# EAGLE design osdelux_proto1_video (EAGLE 8.5.1)
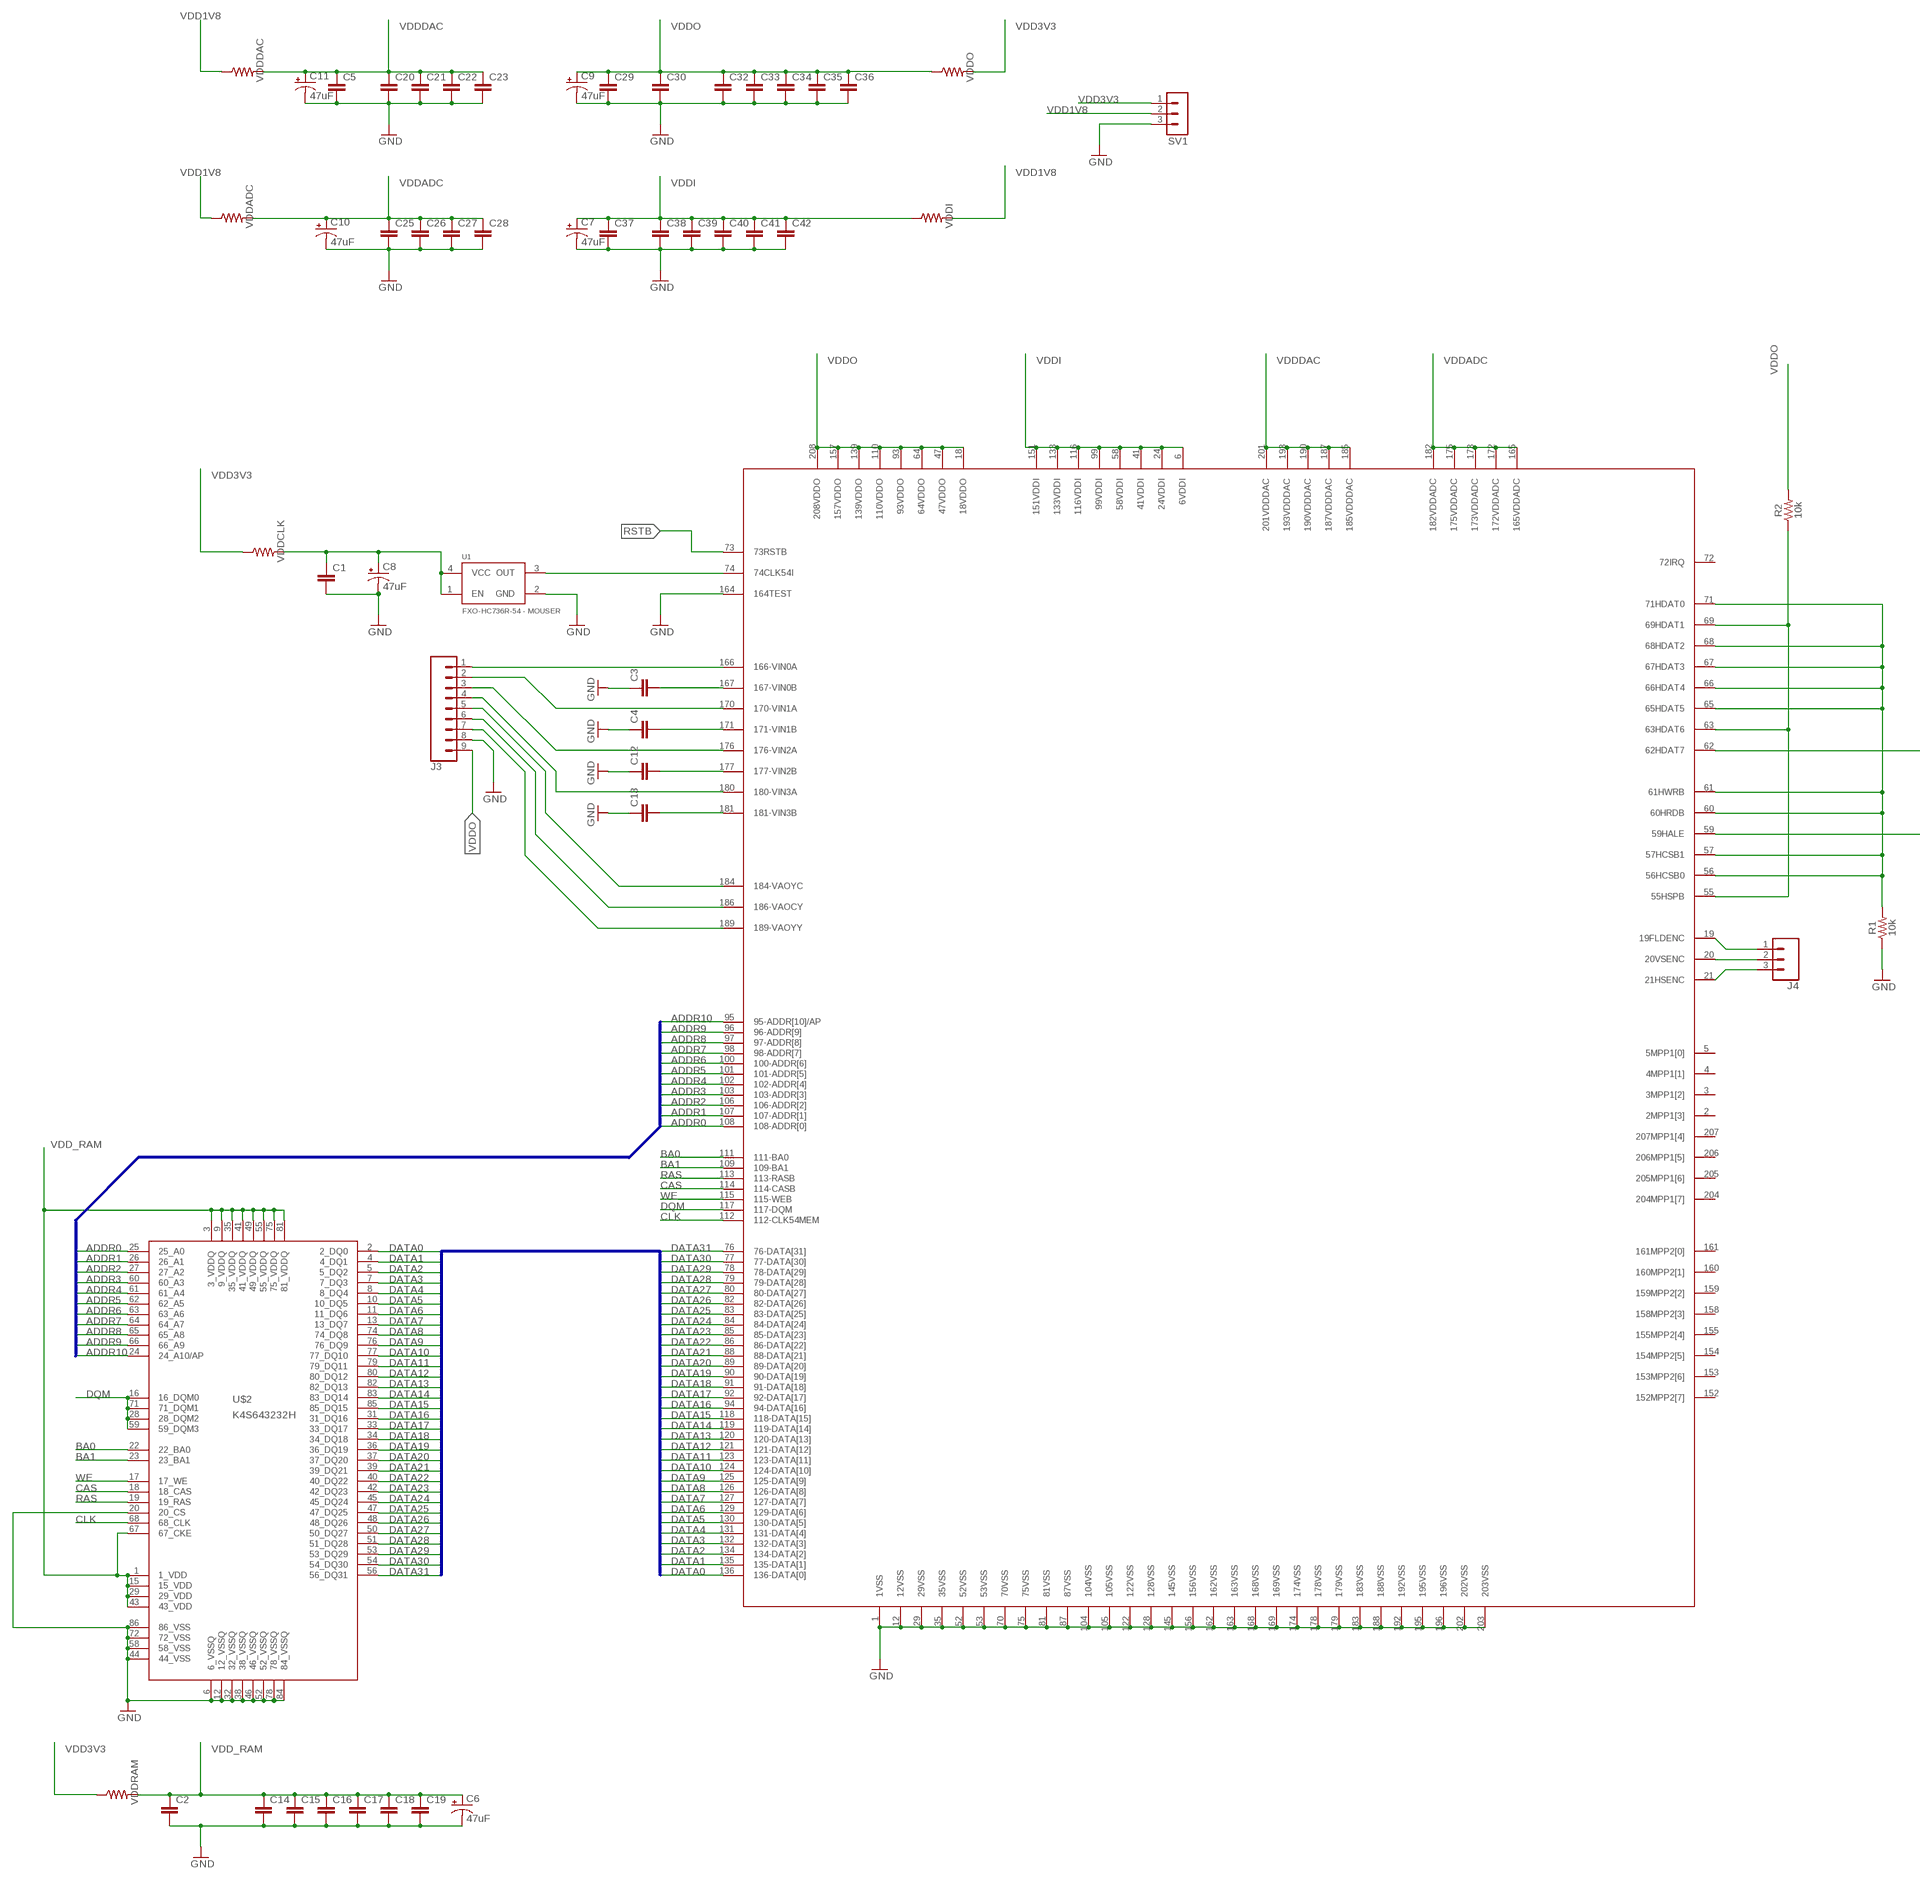
[diagram p0: schematic, sheet 1, part 1 of 2]
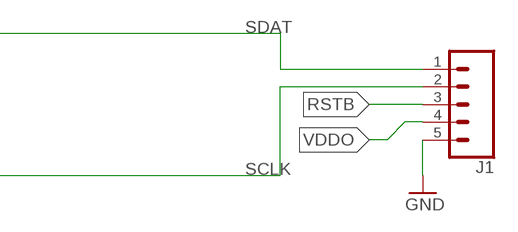
[diagram p1: schematic, sheet 1, part 2 of 2]

## Parts
C1  CAP0805  [0805]
C2  CAP0805  [0805]
C3  CAP0805  [0805]
C4  CAP0805  [0805]
C5  CAP0805  [0805]
C6  47uF  47UF-POLAR-EIA3528-10V-10%  [EIA3528]
C7  47uF  47UF-POLAR-EIA3528-10V-10%  [EIA3528]
C8  47uF  47UF-POLAR-EIA3528-10V-10%  [EIA3528]
C9  47uF  47UF-POLAR-EIA3528-10V-10%  [EIA3528]
C10  47uF  47UF-POLAR-EIA3528-10V-10%  [EIA3528]
C11  47uF  47UF-POLAR-EIA3528-10V-10%  [EIA3528]
C12  CAP0805  [0805]
C13  CAP0805  [0805]
C14  CAP0805  [0805]
C15  CAP0805  [0805]
C16  CAP0805  [0805]
C17  CAP0805  [0805]
C18  CAP0805  [0805]
C19  CAP0805  [0805]
C20  CAP0805  [0805]
C21  CAP0805  [0805]
C22  CAP0805  [0805]
C23  CAP0805  [0805]
C25  CAP0805  [0805]
C26  CAP0805  [0805]
C27  CAP0805  [0805]
C28  CAP0805  [0805]
C29  CAP0805  [0805]
C30  CAP0805  [0805]
C32  CAP0805  [0805]
C33  CAP0805  [0805]
C34  CAP0805  [0805]
C35  CAP0805  [0805]
C36  CAP0805  [0805]
C37  CAP0805  [0805]
C38  CAP0805  [0805]
C39  CAP0805  [0805]
C40  CAP0805  [0805]
C41  CAP0805  [0805]
C42  CAP0805  [0805]
J1  CONN_05LOCK_LONGPADS  [1X05_LOCK_LONGPADS]
J3  CONN_09LOCK-LONGPADS  [1X09_LOCK_LONGPADS]
J4  CONN_03LOCK_LONGPADS  [1X03_LOCK_LONGPADS]
R1  10k  RESISTOR0805  [0805]
R2  10k  RESISTOR0805  [0805]
SV1  MA03-1  [MA03-1]
U1  FXO-HC736R-54 - MOUSER  OSCILLATORSMD6  [CRYSTAL-SMD-7.5X5.2-6PIN]
U$1  TW2823  [LQFP208]
U$2  K4S643232H  [TSOP86]
VDDADC  RESISTOR1206  [1206]
VDDCLK  RESISTOR1206  [1206]
VDDDAC  RESISTOR1206  [1206]
VDDI  RESISTOR1206  [1206]
VDDO  RESISTOR1206  [1206]
VDDRAM  RESISTOR1206  [1206]

## Nets
ADDR0: U$1.108(108-ADDR[0]) U$2.25(25_A0)
ADDR1: U$1.107(107-ADDR[1]) U$2.26(26_A1)
ADDR2: U$1.106(106-ADDR[2]) U$2.27(27_A2)
ADDR3: U$1.103(103-ADDR[3]) U$2.60(60_A3)
ADDR4: U$1.102(102-ADDR[4]) U$2.61(61_A4)
ADDR5: U$1.101(101-ADDR[5]) U$2.62(62_A5)
ADDR6: U$1.100(100-ADDR[6]) U$2.63(63_A6)
ADDR7: U$1.98(98-ADDR[7]) U$2.64(64_A7)
ADDR8: U$1.97(97-ADDR[8]) U$2.65(65_A8)
ADDR9: U$1.96(96-ADDR[9]) U$2.66(66_A9)
ADDR10: U$1.95(95-ADDR[10]/AP) U$2.24(24_A10/AP)
BA0: U$1.111(111-BA0) U$2.22(22_BA0)
BA1: U$1.109(109-BA1) U$2.23(23_BA1)
CAS: U$1.114(114-CASB) U$2.18(18_CAS)
CLK: U$1.112(112-CLK54MEM) U$2.68(68_CLK)
DATA0: U$1.136(136-DATA[0]) U$2.2(2_DQ0)
DATA1: U$1.135(135-DATA[1]) U$2.4(4_DQ1)
DATA2: U$1.134(134-DATA[2]) U$2.5(5_DQ2)
DATA3: U$1.132(132-DATA[3]) U$2.7(7_DQ3)
DATA4: U$1.131(131-DATA[4]) U$2.8(8_DQ4)
DATA5: U$1.130(130-DATA[5]) U$2.10(10_DQ5)
DATA6: U$1.129(129-DATA[6]) U$2.11(11_DQ6)
DATA7: U$1.127(127-DATA[7]) U$2.13(13_DQ7)
DATA8: U$1.126(126-DATA[8]) U$2.74(74_DQ8)
DATA9: U$1.125(125-DATA[9]) U$2.76(76_DQ9)
DATA10: U$1.124(124-DATA[10]) U$2.77(77_DQ10)
DATA11: U$1.123(123-DATA[11]) U$2.79(79_DQ11)
DATA12: U$1.121(121-DATA[12]) U$2.80(80_DQ12)
DATA13: U$1.120(120-DATA[13]) U$2.82(82_DQ13)
DATA14: U$1.119(119-DATA[14]) U$2.83(83_DQ14)
DATA15: U$1.118(118-DATA[15]) U$2.85(85_DQ15)
DATA16: U$1.94(94-DATA[16]) U$2.31(31_DQ16)
DATA17: U$1.92(92-DATA[17]) U$2.33(33_DQ17)
DATA18: U$1.91(91-DATA[18]) U$2.34(34_DQ18)
DATA19: U$1.90(90-DATA[19]) U$2.36(36_DQ19)
DATA20: U$1.89(89-DATA[20]) U$2.37(37_DQ20)
DATA21: U$1.88(88-DATA[21]) U$2.39(39_DQ21)
DATA22: U$1.86(86-DATA[22]) U$2.40(40_DQ22)
DATA23: U$1.85(85-DATA[23]) U$2.42(42_DQ23)
DATA24: U$1.84(84-DATA[24]) U$2.45(45_DQ24)
DATA25: U$1.83(83-DATA[25]) U$2.47(47_DQ25)
DATA26: U$1.82(82-DATA[26]) U$2.48(48_DQ26)
DATA27: U$1.80(80-DATA[27]) U$2.50(50_DQ27)
DATA28: U$1.79(79-DATA[28]) U$2.51(51_DQ28)
DATA29: U$1.78(78-DATA[29]) U$2.53(53_DQ29)
DATA30: U$1.77(77-DATA[30]) U$2.54(54_DQ30)
DATA31: U$1.76(76-DATA[31]) U$2.56(56_DQ31)
DQM: U$1.117(117-DQM) U$2.16(16_DQM0) U$2.28(28_DQM2) U$2.59(59_DQM3) U$2.71(71_DQM1)
FLD: J4.1 U$1.19(19FLDENC)
GND: C1.2 C2.2 C3.1 C4.1 C5.2 C6.C(-) C7.C(-) C8.C(-) C9.C(-) C10.C(-) C11.C(-) C12.1 C13.1 C14.2 C15.2 C16.2 C17.2 C18.2 C19.2 C20.2 C21.2 C22.2 C23.2 C25.2 C26.2 C27.2 C28.2 C29.2 C30.2 C32.2 C33.2 C34.2 C35.2 C36.2 C37.2 C38.2 C39.2 C40.2 C41.2 C42.2 J1.5 J3.8 R1.1 SV1.3 U1.2(GND) U$1.1(1VSS) U$1.12(12VSS) U$1.29(29VSS) U$1.35(35VSS) U$1.52(52VSS) U$1.53(53VSS) U$1.70(70VSS) U$1.75(75VSS) U$1.81(81VSS) U$1.87(87VSS) U$1.104(104VSS) U$1.105(105VSS) U$1.122(122VSS) U$1.128(128VSS) U$1.145(145VSS) U$1.156(156VSS) U$1.162(162VSS) U$1.163(163VSS) U$1.164(164TEST) U$1.168(168VSS) U$1.169(169VSS) U$1.174(174VSS) U$1.178(178VSS) U$1.179(179VSS) U$1.183(183VSS) U$1.188(188VSS) U$1.192(192VSS) U$1.195(195VSS) U$1.196(196VSS) U$1.202(202VSS) U$1.203(203VSS) U$2.6(6_VSSQ) U$2.12(12_VSSQ) U$2.20(20_CS) U$2.32(32_VSSQ) U$2.38(38_VSSQ) U$2.44(44_VSS) U$2.46(46_VSSQ) U$2.52(52_VSSQ) U$2.58(58_VSS) U$2.72(72_VSS) U$2.78(78_VSSQ) U$2.84(84_VSSQ) U$2.86(86_VSS)
HSYNC: J4.3 U$1.21(21HSENC)
N$1: C1.1 C8.A(+) U1.1(EN) U1.4(VCC) VDDCLK.2
N$2: U1.3(OUT) U$1.74(74CLK54I)
N$6: C3.2 U$1.167(167-VIN0B)
N$7: C4.2 U$1.171(171-VIN1B)
N$8: C12.2 U$1.177(177-VIN2B)
N$10: C13.2 U$1.181(181-VIN3B)
N$18: R1.2 U$1.56(56HCSB0) U$1.57(57HCSB1) U$1.60(60HRDB) U$1.61(61HWRB) U$1.65(65HDAT5) U$1.66(66HDAT4) U$1.67(67HDAT3) U$1.68(68HDAT2) U$1.71(71HDAT0)
N$23: R2.1 U$1.55(55HSPB) U$1.63(63HDAT6) U$1.69(69HDAT1)
RAS: U$1.113(113-RASB) U$2.19(19_RAS)
RSTB: J1.3 U$1.73(73RSTB)
SCLK: J1.2 U$1.59(59HALE)
SDAT: J1.1 U$1.62(62HDAT7)
VAOCY: J3.6 U$1.186(186-VAOCY)
VAOYC: J3.5 U$1.184(184-VAOYC)
VAOYY: J3.7 U$1.189(189-VAOYY)
VDD1V8: SV1.2 VDDADC.1 VDDDAC.1 VDDI.2
VDD3V3: SV1.1 VDDCLK.1 VDDO.2 VDDRAM.1
VDD_RAM: C2.1 C6.A(+) C14.1 C15.1 C16.1 C17.1 C18.1 C19.1 U$2.1(1_VDD) U$2.3(3_VDDQ) U$2.9(9_VDDQ) U$2.15(15_VDD) U$2.29(29_VDD) U$2.35(35_VDDQ) U$2.41(41_VDDQ) U$2.43(43_VDD) U$2.49(49_VDDQ) U$2.55(55_VDDQ) U$2.67(67_CKE) U$2.75(75_VDDQ) U$2.81(81_VDDQ) VDDRAM.2
VDDADC: C10.A(+) C25.1 C26.1 C27.1 C28.1 U$1.165(165VDDADC) U$1.172(172VDDADC) U$1.173(173VDDADC) U$1.175(175VDDADC) U$1.182(182VDDADC) VDDADC.2
VDDDAC: C5.1 C11.A(+) C20.1 C21.1 C22.1 C23.1 U$1.185(185VDDDAC) U$1.187(187VDDDAC) U$1.190(190VDDDAC) U$1.193(193VDDDAC) U$1.201(201VDDDAC) VDDDAC.2
VDDI: C7.A(+) C37.1 C38.1 C39.1 C40.1 C41.1 C42.1 U$1.6(6VDDI) U$1.24(24VDDI) U$1.41(41VDDI) U$1.58(58VDDI) U$1.99(99VDDI) U$1.116(116VDDI) U$1.133(133VDDI) U$1.151(151VDDI) VDDI.1
VDDO: C9.A(+) C29.1 C30.1 C32.1 C33.1 C34.1 C35.1 C36.1 J1.4 J3.9 R2.2 U$1.18(18VDDO) U$1.47(47VDDO) U$1.64(64VDDO) U$1.93(93VDDO) U$1.110(110VDDO) U$1.139(139VDDO) U$1.157(157VDDO) U$1.208(208VDDO) VDDO.1
VIN0: J3.1 U$1.166(166-VIN0A)
VIN1: J3.2 U$1.170(170-VIN1A)
VIN2: J3.3 U$1.176(176-VIN2A)
VIN3: J3.4 U$1.180(180-VIN3A)
VSYNC: J4.2 U$1.20(20VSENC)
WE: U$1.115(115-WEB) U$2.17(17_WE)
Unconnected: U$1.2(2MPP1[3]) U$1.3(3MPP1[2]) U$1.4(4MPP1[1]) U$1.5(5MPP1[0]) U$1.152(152MPP2[7]) U$1.153(153MPP2[6]) U$1.154(154MPP2[5]) U$1.155(155MPP2[4]) U$1.158(158MPP2[3]) U$1.159(159MPP2[2]) U$1.160(160MPP2[1]) U$1.161(161MPP2[0]) U$1.204(204MPP1[7]) U$1.205(205MPP1[6]) U$1.206(206MPP1[5]) U$1.207(207MPP1[4])

## Buses
DATA[0..31]
ADDR[0..10]

## Power pins joined to a net without a drawn wire
72IRQ: U$1.72(72IRQ)

## Library data of the parts
C1-C5 C12-C23 C25-C30 C32-C42 = SparkFun:CAP: Capacitor Standard 0603 ceramic capacitor, and 0.1" leaded capacitor.
C6-C11 = SparkFun-Capacitors:47UF-POLAR: 47µF polarized capacitors A capacitor is a passive two-terminal electrical component used to store electrical energy temporarily in an electric field.; PROD_ID: CAP-08310
J1 = SparkFun-Connectors:CONN_05: Multi connection point. Often used as Generic Header-pin footprint for 0.1 inch spaced/style header connections On any of the 0.1 inch spaced packages, you can populate with these: Break Away Headers - Straight <https://www.sparkfun.com/products/116> (PRT-00116) Break Away Male Headers - Right Angle <https://www.sparkfun.com/products/553> (PRT-00553) Female Headers <https://www.sparkfun.com/products/115> (PRT-00115) Break Away Headers - Machine Pin <https://www.sparkfun.com/products/117> (PRT-00117) Break Away Female Headers - Swiss Machine Pin <https://www.sparkfun.com/products/743> (PRT-00743) For SCREWTERMINALS and SPRING TERMINALS visit here: Screw Terimnals on SparkFun.com <https://www.sparkfun.com/search/results?term=Screw+Terminals> (5mm/3.5mm/2.54mm spacing) This device is also useful as a general connection point to wire up your design to another part of your project. Our various solder wires solder well into these plated through hole pads. Hook-Up Wire - Assortment (Stranded, 22 AWG) <https://www.sparkfun.com/products/11375> (PRT-11375) Hook-Up Wire - Assortment (Solid Core, 22 AWG) <https://www.sparkfun.com/products/11367> (PRT-11367) View the entire wire category on our website here <https://www.sparkfun.com/categories/141> Special notes: Molex polarized connector foot print use with SKU : PRT-08231 with associated crimp pins and housings. 1MM SMD Version SKU: PRT-10208
J3 = SparkFun-Connectors:CONN_09: Multi connection point. Often used as Generic Header-pin footprint for 0.1 inch spaced/style header connections On any of the 0.1 inch spaced packages, you can populate with these: Break Away Headers - Straight <https://www.sparkfun.com/products/116> (PRT-00116) Break Away Male Headers - Right Angle <https://www.sparkfun.com/products/553> (PRT-00553) Female Headers <https://www.sparkfun.com/products/115> (PRT-00115) Break Away Headers - Machine Pin <https://www.sparkfun.com/products/117> (PRT-00117) Break Away Female Headers - Swiss Machine Pin <https://www.sparkfun.com/products/743> (PRT-00743) For SCREWTERMINALS and SPRING TERMINALS visit here: Screw Terimnals on SparkFun.com <https://www.sparkfun.com/search/results?term=Screw+Terminals> (5mm/3.5mm/2.54mm spacing) This device is also useful as a general connection point to wire up your design to another part of your project. Our various solder wires solder well into these plated through hole pads. Hook-Up Wire - Assortment (Stranded, 22 AWG) <https://www.sparkfun.com/products/11375> (PRT-11375) Hook-Up Wire - Assortment (Solid Core, 22 AWG) <https://www.sparkfun.com/products/11367> (PRT-11367) View the entire wire category on our website here <https://www.sparkfun.com/categories/141> Special notes: Molex polarized connector foot print use with SKU : PRT-08231 with associated crimp pins and housings. 1MM SMD Version SKU: PRT-10208 NOTES ON THE VARIANTS LOCK and LOCK_LONGPADS... This footprint was designed to help hold the alignment of a through-hole component (i.e. 6-pin header) while soldering it into place. You may notice that each hole has been shifted either up or down by 0.005 of an inch from it's more standard position (which is a perfectly straight line). This slight alteration caused the pins (the squares in the middle) to touch the edges of the holes. Because they are alternating, it causes a "brace" to hold the component in place. 0.005 has proven to be the perfect amount of "off-center" position when using our standard breakaway headers. Although looks a little odd when you look at the bare footprint, once you have a header in there, the alteration is very hard to notice. Also,if you push a header all the way into place, it is covered up entirely on the bottom side.
J4 = SparkFun-Connectors:CONN_03: Multi connection point. Often used as Generic Header-pin footprint for 0.1 inch spaced/style header connections On any of the 0.1 inch spaced packages, you can populate with these: Break Away Headers - Straight <https://www.sparkfun.com/products/116> (PRT-00116) Break Away Male Headers - Right Angle <https://www.sparkfun.com/products/553> (PRT-00553) Female Headers <https://www.sparkfun.com/products/115> (PRT-00115) Break Away Headers - Machine Pin <https://www.sparkfun.com/products/117> (PRT-00117) Break Away Female Headers - Swiss Machine Pin <https://www.sparkfun.com/products/743> (PRT-00743) Stackable Header - 3 Pin (Female, 0.1") <https://www.sparkfun.com/products/13875> (PRT-13875) For SCREWTERMINALS and SPRING TERMINALS visit here: Screw Terimnals on SparkFun.com <https://www.sparkfun.com/search/results?term=Screw+Terminals> (5mm/3.5mm/2.54mm spacing) This device is also useful as a general connection point to wire up your design to another part of your project. Our various solder wires solder well into these plated through hole pads. Hook-Up Wire - Assortment (Stranded, 22 AWG) <https://www.sparkfun.com/products/11375> (PRT-11375) Hook-Up Wire - Assortment (Solid Core, 22 AWG) <https://www.sparkfun.com/products/11367> (PRT-11367) View the entire wire category on our website here <https://www.sparkfun.com/categories/141> Special notes: Molex polarized connector foot print use with SKU : PRT-08232 with associated crimp pins and housings.
R1 R2 VDDADC VDDCLK VDDDAC VDDI VDDO VDDRAM = SparkFun-Resistors:RESISTOR: Generic Resistor Package
SV1 = con-lstb:MA03-1: PIN HEADER; OC_FARNELL: unknown; OC_NEWARK: unknown
U1 = SparkFun:OSCILLATOR
U$1 = microbuilder:TW2823
U$2 = sdram:K4S643232H

## Board
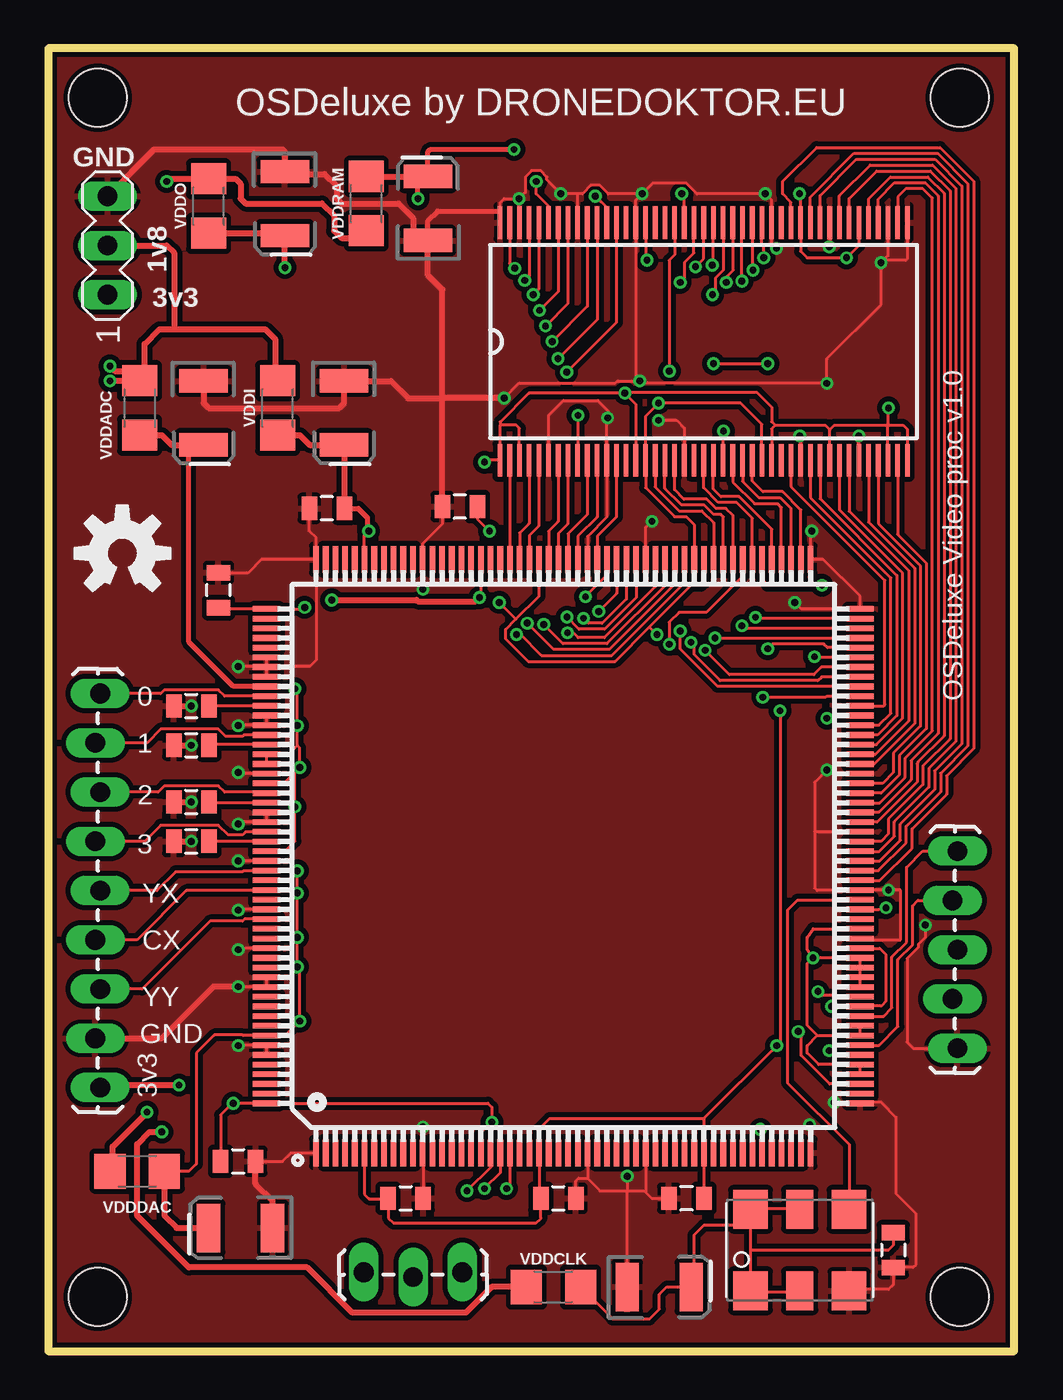
[diagram p2: board, top side]
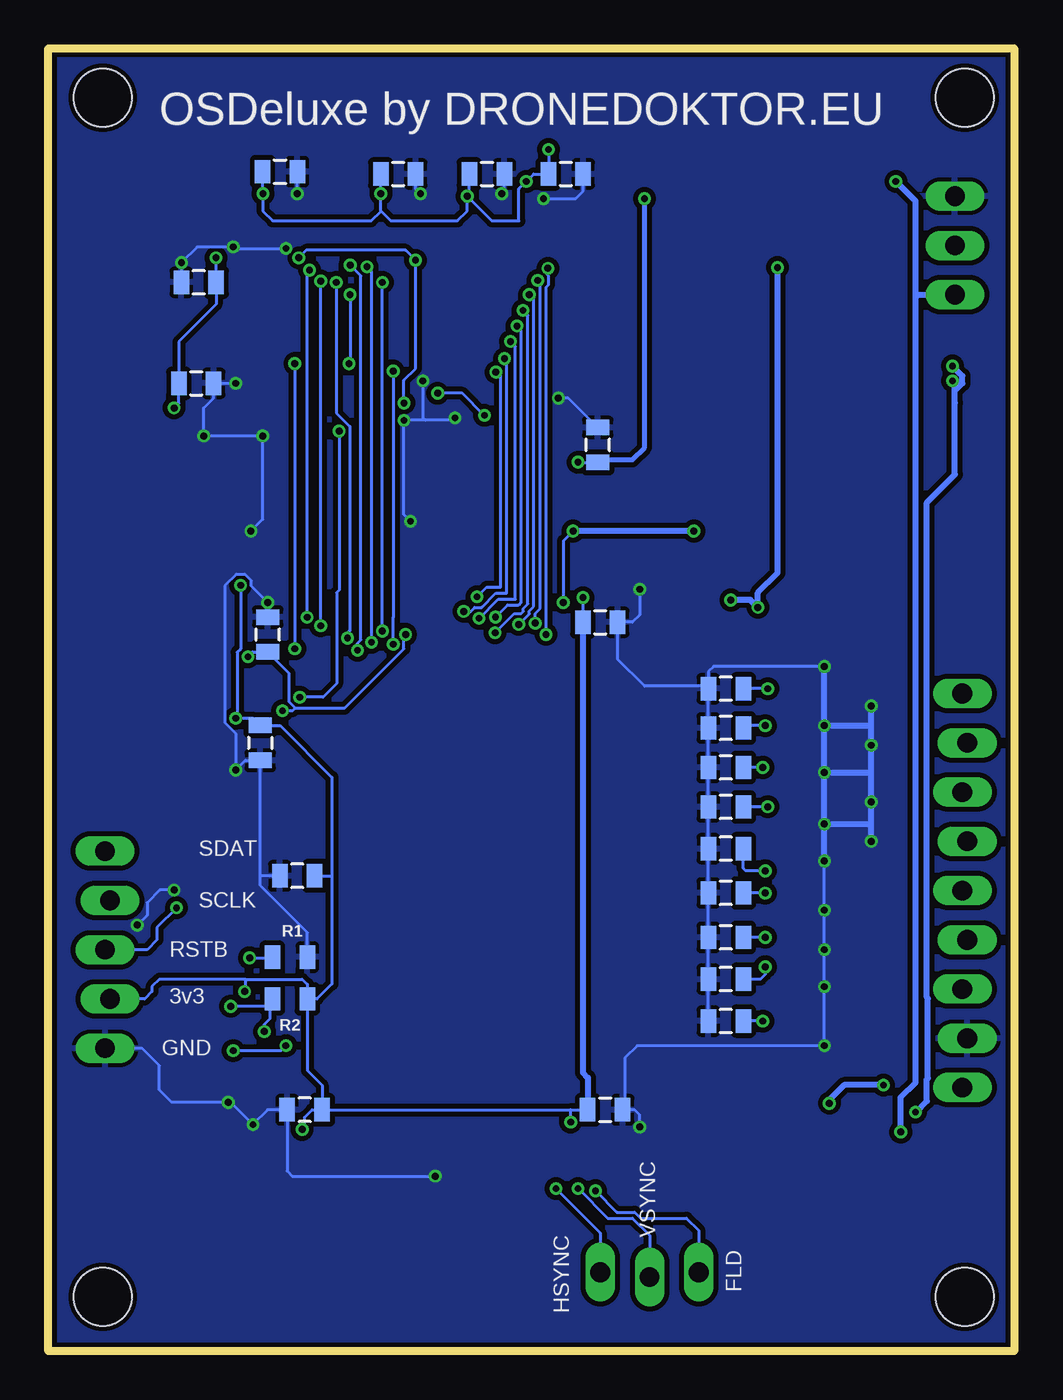
[diagram p3: board, bottom side, seen from below]

Size 49.78 x 67.18 mm. Coordinates in mm from the lower left corner, seen from the top.
Outline: 0,0 49.78,0 49.78,67.18 0,67.18 0,0
Copper layers (1*16): Top 0.018mm / dielectric 1.55mm / Bottom 0.018mm
Design rules "default *": minimum track width 6mil, minimum drill 0.3mm, track to track 6mil, track to pad 6mil, pad to pad 6mil, via to via 6mil, smd to smd 0mil, copper to edge 0.25mm, drill to drill 0.35mm, minimum pad ring 6mil, minimum via ring 6mil, stop-mask expansion 0mil, vias tented up to drill 0.45mm, thermal gap 0.2mm
Holes 3 mm at 46.99,2.79 46.99,64.64 2.54,64.64 2.54,2.79

### Footprints (pad centres in the part's own frame; a part is rotated, then mirrored left to right if it is on the bottom)
0805 = smd 0.8 x 1.2: 1 -0.9,0; 2 0.9,0
EIA3528 = smd 1.2 x 2.5: A 1.65,0; C -1.65,0
1X05_LOCK_LONGPADS = drill 1.016 long: 1 0,0; 2 2.54,-0.254; 3 5.08,0; 4 7.62,-0.254; 5 10.16,0
1X09_LOCK_LONGPADS = drill 1.016 long: 1 0,0.127; 2 2.54,-0.127; 3 5.08,0.127; 4 7.62,-0.127; 5 10.16,0.127; 6 12.7,-0.127; 7 15.24,0.127; 8 17.78,-0.127; 9 20.32,0.127
1X03_LOCK_LONGPADS = drill 1.016 long: 1 0,0; 2 2.54,-0.254; 3 5.08,0
MA03-1 = drill 1.016 long: 1 -2.54,0; 2 0,0; 3 2.54,0
CRYSTAL-SMD-7.5X5.2-6PIN = smd 1.8 x 2: 1 -2.54,-2.1; 2 2.54,-2.1; 3 2.54,2.1; 4 -2.54,2.1 | smd 1.4 x 2: NC0 0,-2.1; NC1 0,2.1
LQFP208 = smd 1.4 x 0.29: 1 -15.3,12.75; 2 -15.3,12.25; 3 -15.3,11.75; 4 -15.3,11.25; 5 -15.3,10.75; 6 -15.3,10.25; 7 -15.3,9.75; 8 -15.3,9.25; 9 -15.3,8.75; 10 -15.3,8.25; 11 -15.3,7.75; 12 -15.3,7.25; 13 -15.3,6.75; 14 -15.3,6.25; 15 -15.3,5.75; 16 -15.3,5.25; 17 -15.3,4.75; 18 -15.3,4.25; 19 -15.3,3.75; 20 -15.3,3.25; 21 -15.3,2.75; 22 -15.3,2.25; 23 -15.3,1.75; 24 -15.3,1.25; 25 -15.3,0.75; 26 -15.3,0.25; 27 -15.3,-0.25; 28 -15.3,-0.75; 29 -15.3,-1.25; 30 -15.3,-1.75; 31 -15.3,-2.25; 32 -15.3,-2.75; 33 -15.3,-3.25; 34 -15.3,-3.75; 35 -15.3,-4.25; 36 -15.3,-4.75; 37 -15.3,-5.25; 38 -15.3,-5.75; 39 -15.3,-6.25; 40 -15.3,-6.75; 41 -15.3,-7.25; 42 -15.3,-7.75; 43 -15.3,-8.25; 44 -15.3,-8.75; 45 -15.3,-9.25; 46 -15.3,-9.75; 47 -15.3,-10.25; 48 -15.3,-10.75; 49 -15.3,-11.25; 50 -15.3,-11.75; 51 -15.3,-12.25; 52 -15.3,-12.75; 105 15.3,-12.75; 106 15.3,-12.25; 107 15.3,-11.75; 108 15.3,-11.25; 109 15.3,-10.75; 110 15.3,-10.25; 111 15.3,-9.75; 112 15.3,-9.25; 113 15.3,-8.75; 114 15.3,-8.25; 115 15.3,-7.75; 116 15.3,-7.25; 117 15.3,-6.75; 118 15.3,-6.25; 119 15.3,-5.75; 120 15.3,-5.25; 121 15.3,-4.75; 122 15.3,-4.25; 123 15.3,-3.75; 124 15.3,-3.25; 125 15.3,-2.75; 126 15.3,-2.25; 127 15.3,-1.75; 128 15.3,-1.25; 129 15.3,-0.75; 130 15.3,-0.25; 131 15.3,0.25; 132 15.3,0.75; 133 15.3,1.25; 134 15.3,1.75; 135 15.3,2.25; 136 15.3,2.75; 137 15.3,3.25; 138 15.3,3.75; 139 15.3,4.25; 140 15.3,4.75; 141 15.3,5.25; 142 15.3,5.75; 143 15.3,6.25; 144 15.3,6.75; 145 15.3,7.25; 146 15.3,7.75; 147 15.3,8.25; 148 15.3,8.75; 149 15.3,9.25; 150 15.3,9.75; 151 15.3,10.25; 152 15.3,10.75; 153 15.3,11.25; 154 15.3,11.75; 155 15.3,12.25; 156 15.3,12.75 | smd 0.29 x 1.4: 53 -12.75,-15.3; 54 -12.25,-15.3; 55 -11.75,-15.3; 56 -11.25,-15.3; 57 -10.75,-15.3; 58 -10.25,-15.3; 59 -9.75,-15.3; 60 -9.25,-15.3; 61 -8.75,-15.3; 62 -8.25,-15.3; 63 -7.75,-15.3; 64 -7.25,-15.3; 65 -6.75,-15.3; 66 -6.25,-15.3; 67 -5.75,-15.3; 68 -5.25,-15.3; 69 -4.75,-15.3; 70 -4.25,-15.3; 71 -3.75,-15.3; 72 -3.25,-15.3; 73 -2.75,-15.3; 74 -2.25,-15.3; 75 -1.75,-15.3; 76 -1.25,-15.3; 77 -0.75,-15.3; 78 -0.25,-15.3; 79 0.25,-15.3; 80 0.75,-15.3; 81 1.25,-15.3; 82 1.75,-15.3; 83 2.25,-15.3; 84 2.75,-15.3; 85 3.25,-15.3; 86 3.75,-15.3; 87 4.25,-15.3; 88 4.75,-15.3; 89 5.25,-15.3; 90 5.75,-15.3; 91 6.25,-15.3; 92 6.75,-15.3; 93 7.25,-15.3; 94 7.75,-15.3; 95 8.25,-15.3; 96 8.75,-15.3; 97 9.25,-15.3; 98 9.75,-15.3; 99 10.25,-15.3; 100 10.75,-15.3; 101 11.25,-15.3; 102 11.75,-15.3; 103 12.25,-15.3; 104 12.75,-15.3; 157 12.75,15.3; 158 12.25,15.3; 159 11.75,15.3; 160 11.25,15.3; 161 10.75,15.3; 162 10.25,15.3; 163 9.75,15.3; 164 9.25,15.3; 165 8.75,15.3; 166 8.25,15.3; 167 7.75,15.3; 168 7.25,15.3; 169 6.75,15.3; 170 6.25,15.3; 171 5.75,15.3; 172 5.25,15.3; 173 4.75,15.3; 174 4.25,15.3; 175 3.75,15.3; 176 3.25,15.3; 177 2.75,15.3; 178 2.25,15.3; 179 1.75,15.3; 180 1.25,15.3; 181 0.75,15.3; 182 0.25,15.3; 183 -0.25,15.3; 184 -0.75,15.3; 185 -1.25,15.3; 186 -1.75,15.3; 187 -2.25,15.3; 188 -2.75,15.3; 189 -3.25,15.3; 190 -3.75,15.3; 191 -4.25,15.3; 192 -4.75,15.3; 193 -5.25,15.3; 194 -5.75,15.3; 195 -6.25,15.3; 196 -6.75,15.3; 197 -7.25,15.3; 198 -7.75,15.3; 199 -8.25,15.3; 200 -8.75,15.3; 201 -9.25,15.3; 202 -9.75,15.3; 203 -10.25,15.3; 204 -10.75,15.3; 205 -11.25,15.3; 206 -11.75,15.3; 207 -12.25,15.3; 208 -12.75,15.3
TSOP86 = smd 1.7 x 0.24: 1 -6.13,10.5; 2 -6.13,10; 3 -6.13,9.5; 4 -6.13,9; 5 -6.13,8.5; 6 -6.13,8; 7 -6.13,7.5; 8 -6.13,7; 9 -6.13,6.5; 10 -6.13,6; 11 -6.13,5.5; 12 -6.13,5; 13 -6.13,4.5; 14 -6.13,4; 15 -6.13,3.5; 16 -6.13,3; 17 -6.13,2.5; 18 -6.13,2; 19 -6.13,1.5; 20 -6.13,1; 21 -6.13,0.5; 22 -6.13,0; 23 -6.13,-0.5; 24 -6.13,-1; 25 -6.13,-1.5; 26 -6.13,-2; 27 -6.13,-2.5; 28 -6.13,-3; 29 -6.13,-3.5; 30 -6.13,-4; 31 -6.13,-4.5; 32 -6.13,-5; 33 -6.13,-5.5; 34 -6.13,-6; 35 -6.13,-6.5; 36 -6.13,-7; 37 -6.13,-7.5; 38 -6.13,-8; 39 -6.13,-8.5; 40 -6.13,-9; 41 -6.13,-9.5; 42 -6.13,-10; 43 -6.13,-10.5; 44 6.13,-10.5; 45 6.13,-10; 46 6.13,-9.5; 47 6.13,-9; 48 6.13,-8.5; 49 6.13,-8; 50 6.13,-7.5; 51 6.13,-7; 52 6.13,-6.5; 53 6.13,-6; 54 6.13,-5.5; 55 6.13,-5; 56 6.13,-4.5; 57 6.13,-4; 58 6.13,-3.5; 59 6.13,-3; 60 6.13,-2.5; 61 6.13,-2; 62 6.13,-1.5; 63 6.13,-1; 64 6.13,-0.5; 65 6.13,0; 66 6.13,0.5; 67 6.13,1; 68 6.13,1.5; 69 6.13,2; 70 6.13,2.5; 71 6.13,3; 72 6.13,3.5; 73 6.13,4; 74 6.13,4.5; 75 6.13,5; 76 6.13,5.5; 77 6.13,6; 78 6.13,6.5; 79 6.13,7; 80 6.13,7.5; 81 6.13,8; 82 6.13,8.5; 83 6.13,9; 84 6.13,9.5; 85 6.13,10; 86 6.13,10.5
1206 = smd 1.6 x 1.8: 1 -1.4,0; 2 1.4,0

### Placement (x,y rotation side)
C1  43.56,5.21 270 top
C2  21.46,46.74 90 bottom
C3  7.37,33.27 0 top
C4  7.37,31.24 0 top
C5  14.86,25.91 180 bottom
C6  19.56,58.93 90 top
C7  15.24,48.39 270 top
C8  31.5,3.3 0 top
C9  12.19,59.18 270 top
C10  8,48.39 270 top
C11  9.91,6.35 180 top
C12  7.37,28.32 0 top
C13  7.37,26.29 0 top
C14  42.16,49.91 0 bottom
C15  42.04,55.12 180 bottom
C16  23.11,60.71 0 bottom
C17  27.18,60.71 0 bottom
C18  31.75,60.71 0 bottom
C19  37.85,60.83 0 bottom
C20  14.86,23.62 180 bottom
C21  14.86,21.34 180 bottom
C22  14.86,19.18 180 bottom
C23  14.86,17.02 180 bottom
C25  14.86,28.07 180 bottom
C26  14.86,32.13 180 bottom
C27  14.86,30.1 180 bottom
C28  14.86,34.16 180 bottom
C29  9.78,9.78 0 top
C30  21.34,37.59 0 bottom
C32  36.96,24.51 180 bottom
C33  36.58,12.45 180 bottom
C34  8.76,39.24 90 top
C35  38.86,31.37 270 bottom
C36  21.08,12.45 0 bottom
C37  14.35,43.46 180 top
C38  32.89,7.87 180 top
C39  18.41,7.87 0 top
C40  38.48,36.96 90 bottom
C41  21.21,43.56 180 top
C42  26.29,7.87 0 top
J1  46.86,25.78 270 top
J3  2.54,33.91 270 top
J4  16.26,4.06 0 top
R1  37.34,20.32 180 bottom
R2  37.34,18.16 0 bottom
SV1  3.05,57.02 90 top
U1  38.73,5.21 0 top
U$1  26.54,25.53 90 top
U$2  33.78,52.07 90 top
U$3  [OSHW-LOGO-M]  3.81,41.15 0 top
VDDADC  4.7,48.64 270 top
VDDCLK  26.04,3.3 0 top
VDDDAC  4.57,9.27 0 top
VDDI  11.81,48.64 90 top
VDDO  8.25,59.05 90 top
VDDRAM  16.38,59.18 90 top

### Tracks (layer width: path | path; a pad name or v marks a point on that pad's centre or on a via)
ADDR0
  Top 0.152: U$1.108 37.79,43.51 37.61,43.7 36.41,43.7 35.28,44.83 U$2.25
ADDR1
  Top 0.152: U$1.107 38.29,43.44 37.72,44.02 36.63,44.02 35.79,44.86 U$2.26
ADDR2
  Top 0.152: U$1.106 38.79,43.38 37.85,44.32 36.83,44.32 36.28,44.87 U$2.27
ADDR3  (via drill 0.35)
  Top 0.152: U$1.103 36.52,37.78 v36.45,37.85 | v36.32,55.75 36.32,58.16 U$2.60
  Bottom 0.152: v36.45,37.85 36.45,55.63 v36.32,55.75
ADDR4  (via drill 0.35)
  Top 0.152: U$1.102 35.88,37.28 v35.75,37.4 | v35.75,55.18 35.75,58.17 U$2.61
  Bottom 0.152: v35.75,37.4 v35.75,55.18
ADDR5  (via drill 0.35)
  Top 0.152: v34.36,36.78 U$1.101 | U$1.101 | v34.94,55.12 34.94,55.39 35.31,55.75 35.31,58.18 U$2.62
  Bottom 0.152: v34.94,55.12 34.94,48.38 34.24,47.68 34.24,37.16 34.36,37.04 v34.36,36.78
ADDR6  (via drill 0.35)
  Top 0.152: U$2.63 34.78,55.74 34.39,55.35 34.39,54.63 v34.24,54.48 | v34.29,50.93 v37.08,50.93 | 41.79,36.22 U$1.100 40.18,36.28 39.98,36.47 37.34,36.47 v37.08,36.22
  Bottom 0.152: v34.24,54.48 34.24,50.98 v34.29,50.93 | v37.08,50.93 v37.08,36.22
ADDR7  (via drill 0.35)
  Top 0.152: v34.23,56.01 34.28,56.06 U$2.64 | U$1.98 39.85,35.28 39.46,34.89 35.11,34.89 v33.86,36.14
  Bottom 0.152: v33.86,36.14 33.86,36.5 33.68,36.67 33.68,55.46 v34.23,56.01
ADDR8  (via drill 0.35)
  Top 0.152: v33.12,36.55 33.3,36.38 33.3,35.91 34.63,34.58 39.66,34.58 39.86,34.78 U$1.97 | v33.36,55.92 33.78,56.35 U$2.65
  Bottom 0.152: v33.12,36.55 33.12,55.69 v33.36,55.92
ADDR9  (via drill 0.35)
  Top 0.152: U$1.96 34.51,34.28 32.57,36.21 v32.57,37.14 | v32.57,55.12 32.8,55.35 32.8,56.15 33.28,56.64 U$2.66
  Bottom 0.152: v32.57,37.14 v32.57,55.12
ADDR10  (via drill 0.35)
  Top 0.152: U$2.24 34.78,47.43 v34.8,47.45 | v36.83,33.72 40.07,33.72 40.13,33.78 U$1.95
  Bottom 0.152: v34.8,47.45 34.8,39.24 34.93,39.12 34.93,34.42 35.62,33.72 v36.83,33.72
BA0
  Top 0.152: U$1.111 36.29,42.96 35.48,43.76 34.55,43.76 33.78,44.53 U$2.22
BA1
  Top 0.152: U$1.109 37.29,42.39 35.61,44.07 34.67,44.07 34.28,44.46 U$2.23
CAS
  Top 0.152: U$1.114 34.79,43.03 34.67,43.16 34.29,43.16 33.81,43.64 32.64,43.64 31.78,44.5 U$2.18
CLK  (via drill 0.35)
  Top 0.152: U$2.68 32.28,56.54 32,56.26 v32,50.56 v32.01,50.55 | U$1.112 35.79,39.98 33.91,38.1 32.51,38.1 32,37.59 32.01,37.58 v32.01,36.45
  Bottom 0.152: v32.01,50.55 32.01,37.86 | 32.01,37.86 32,37.85 | v32.01,36.45 32.01,37.86
DATA0
  Top 0.152: U$2.2 23.78,40.84 U$1.136
DATA1
  Top 0.152: U$2.4 24.78,42.69 24.29,42.2 U$1.135
DATA2
  Top 0.152: U$2.5 25.28,42.55 24.79,42.06 U$1.134
DATA3
  Top 0.152: U$2.7 26.28,42.79 25.78,42.29 25.78,40.84 U$1.132
DATA4
  Top 0.152: U$2.8 26.78,42.66 26.29,42.16 U$1.131
DATA5
  Top 0.152: U$2.10 27.78,43.15 26.79,42.16 U$1.130
DATA6
  Top 0.152: U$2.11 28.28,43.01 27.29,42.03 U$1.129
DATA7
  Top 0.152: U$2.13 29.28,43.02 28.3,42.04 U$1.127
DATA8  (via drill 0.35)
  Top 0.152: U$1.126 28.79,40.01 v27.69,38.91 | U$2.74 29.28,53.05 v26.72,50.48
  Bottom 0.152: v27.69,38.91 27.2,39.39 26.47,39.39 26.47,50.34 26.61,50.48 v26.72,50.48
DATA9  (via drill 0.35)
  Top 0.152: U$1.125 29.29,39.07 v28.37,38.15 | 28.32,58.16 U$2.76 28.28,53.19 v26.27,51.18
  Bottom 0.152: v28.37,38.15 28.01,38.15 27.81,38.35 27.46,38.35 26.72,39.09 26.16,39.09 26.16,51.07 v26.27,51.18
DATA10  (via drill 0.35)
  Top 0.152: 27.81,58.17 U$2.77 27.78,53.88 v25.97,52.07 | U$1.124 29.79,38.79 28.55,37.54 27.83,37.54 v27.58,37.79
  Bottom 0.152: v27.58,37.79 26.59,38.79 25.72,38.79 25.72,51.82 v25.97,52.07
DATA11  (via drill 0.35)
  Top 0.152: 26.8,58.19 U$2.79 26.78,54.03 v25.63,52.87 | U$1.123 30.29,38.86 28.68,37.24 27.35,37.24 v26.73,37.85
  Bottom 0.152: v26.73,37.85 26.11,38.48 25.55,38.48 25.41,38.62 25.41,52.65 v25.63,52.87
DATA12  (via drill 0.35)
  Top 0.152: U$1.121 31.29,39.42 28.67,36.8 27.3,36.8 27.05,37.05 v26.76,37.05 | U$2.80 26.28,54.64 v25.32,53.68
  Bottom 0.152: v26.76,37.05 25.77,38.03 25.41,38.03 25.3,38.15 25.3,38.3 25.07,38.53 25.07,53.42 v25.32,53.68
DATA13  (via drill 0.35)
  Top 0.152: U$1.120 31.79,39.49 28.79,36.49 26.53,36.49 v25.54,37.48 | U$2.82 25.28,54.77 v24.99,54.48
  Bottom 0.152: v25.54,37.48 24.99,38.03 24.99,38.18 24.76,38.4 24.76,54.26 v24.99,54.48
DATA14  (via drill 0.35)
  Top 0.152: 24.8,58.18 U$2.83 | U$1.119 32.29,39.56 28.92,36.19 26.04,36.19 v24.69,37.54 | 24.76,58.18 U$2.83 | U$2.83 24.78,55.45 v24.56,55.22
  Bottom 0.152: v24.69,37.54 24.69,38.05 24.44,38.3 24.44,55.1 v24.56,55.22
DATA15  (via drill 0.35)
  Top 0.152: v24.13,36.96 24.34,36.96 25.41,35.88 29.04,35.88 32.79,39.63 U$1.118 | 23.75,58.17 U$2.85 23.78,56.1 v24.04,55.85
  Bottom 0.152: v24.04,55.85 24.04,55.49 24,55.45 24,54.99 24.13,54.86 v24.13,36.96
DATA16
  Top 0.152: U$2.31 38.28,44.6 43.13,39.75 43.13,33.35 43.06,33.28 U$1.94
DATA17
  Top 0.152: U$2.33 39.28,44.03 43.43,39.88 43.43,32.89 42.82,32.28 U$1.92
DATA18
  Top 0.152: U$2.34 39.78,43.96 43.74,40 43.74,32.77 42.75,31.78 U$1.91
DATA19
  Top 0.152: U$2.36 40.78,43.39 44.04,40.13 44.04,32.64 42.68,31.28 U$1.90
DATA20
  Top 0.152: U$2.37 41.28,43.32 44.35,40.26 44.35,32.49 42.62,30.76 41.86,30.76 U$1.89
DATA21
  Top 0.152: U$2.39 42.28,42.75 44.65,40.38 44.65,32.36 42.57,30.28 | 42.57,30.28 | 42.57,30.28 U$1.88
DATA22
  Top 0.152: U$2.40 42.78,42.69 44.96,40.51 44.96,32.23 43.56,30.84 43.56,29.85 43,29.29 41.85,29.29 U$1.86
DATA23
  Top 0.152: U$2.42 43.78,42.12 45.26,40.64 45.26,32.11 43.87,30.71 43.87,29.72 42.92,28.78 U$1.85
DATA24
  Top 0.152: 43.82,58.17 U$2.45 43.79,58.21 43.79,59.54 44.2,59.94 45.09,59.94 45.57,59.46 45.57,31.98 44.17,30.58 44.17,29.59 42.86,28.28 U$1.84
DATA25
  Top 0.152: U$1.83 41.88,27.81 42.82,27.81 44.48,29.47 44.48,30.46 45.87,31.86 45.87,59.59 45.21,60.25 43.61,60.25 42.78,59.42 U$2.47
DATA26
  Top 0.152: U$2.48 42.28,59.43 43.41,60.55 45.34,60.55 46.18,59.71 46.18,31.73 44.83,30.38 44.83,30.35 44.78,30.3 44.78,29.34 42.75,27.31 42.72,27.28 U$1.82
DATA27
  Top 0.152: U$2.50 41.28,59.43 41.28,59.44 42.7,60.86 45.46,60.86 46.48,59.84 46.48,31.57 45.09,30.18 45.09,29.21 43.31,27.44 43.31,26.67 42.93,26.29 41.4,26.29 41.39,26.28 | 41.33,26.21 41.39,26.28 | 41.39,26.28 U$1.80
DATA28
  Top 0.152: U$2.51 40.78,59.58 42.37,61.16 45.59,61.16 46.79,59.97 46.79,31.45 45.39,30.05 45.39,29.09 43.61,27.31 43.61,26.54 42.85,25.78 U$1.79
DATA29
  Top 0.152: U$2.53 39.78,59.59 41.66,61.47 45.72,61.47 47.09,60.09 47.09,31.32 45.7,29.92 45.7,28.96 43.92,27.18 43.92,26.34 42.85,25.28 U$1.78
DATA30
  Top 0.152: 41.86,24.77 U$1.77 42.78,24.78 44.22,26.21 44.22,27.06 46,28.83 46,29.8 47.4,31.19 47.4,60.22 45.84,61.77 41.53,61.77 39.28,59.52 U$2.54
DATA31
  Top 0.152: U$1.76 42.87,24.28 44.53,25.93 44.53,26.93 46.3,28.71 46.3,29.67 47.7,31.07 47.7,60.34 45.97,62.08 39.6,62.08 37.85,60.33 37.85,59.69 38.28,59.25 U$2.56
DQM  (via drill 0.35)
  Top 0.152: U$1.117 33.29,42.63 32.89,43.03 32.28,43.03 30.78,44.53 U$2.16 30.78,48.22 v31.46,48.89 | U$2.71 30.78,56.34 v30.86,56.26 | v36.88,56.39 36.88,56.97 36.78,57.07 U$2.59 | v31.46,48.89 31.5,48.89 | v31.46,48.89 31.46,48.93 31.5,48.89 | U$2.28 36.78,47.8 35.69,48.89 31.5,48.89
  Bottom 0.152: v31.46,48.89 31.46,50.08 30.86,50.67 v30.86,56.26 31.37,56.77 36.5,56.77 v36.88,56.39
FLD  (via drill 0.35)
  Top 0.152: U$1.19 22.79,9.48 v21.58,8.27
  Bottom 0.152: v21.58,8.27 20.47,7.16 19.56,7.16 19.25,6.86 16.89,6.86 16.26,6.22 J4.1
GND  (via drill 0.35)
  Top 0.152: U$1.128 27.79,42.02 28.78,43.01 U$2.12 28.78,48.09 v28.83,48.13 28.83,48.51 28.32,49.02 26.54,49.02 25.78,48.26 U$2.6 | U$2.38 v41.78,47.19 v41.78,47.2 | U$2.32 38.78,47.15 v38.73,47.2 | v39.35,42.29 39.29,42.23 U$1.105 39.95,40.83 41.84,38.93 U$1.104 38.81,38.28 v38.48,38.61 | U$2.46 43.28,56.49 v42.93,56.13 | U$2.44 44.28,56.35 44.2,56.26 43.05,56.26 v42.93,56.13 | U$2.52 40.28,56.97 v40.26,56.94 | v37.54,56.87 37.29,57.12 U$2.58 37.28,59.36 v36.96,59.69 33.44,59.69 32.88,60.25 31.16,60.25 v30.61,59.69 | U$1.122 30.79,42.48 v31.11,42.8 | v31.46,48.01 32.39,48.01 32.78,47.61 U$2.20 | v30.48,50.04 30.61,49.91 v40.13,49.91 40.13,51.18 42.93,53.97 v42.93,56.13 | v30.61,59.69 30.28,59.36 U$2.72 30.28,50.24 v30.48,50.04 | v30.61,59.69 28.85,59.69 28.42,60.12 27.96,60.12 27.54,59.69 27.3,59.69 | 27.3,59.69 v26.42,59.69 25.7,60.4 25.7,60.55 25.38,60.88 24.92,60.88 24.59,60.55 24.59,59.77 v24.26,59.44 | U$2.84 24.26,58.22 v24.26,59.44 | U$2.86 23.28,58.8 23.28,59.22 23.5,59.44 v24.26,59.44 | 30.4,49.96 v30.48,50.04 | U$1.87 40.33,29.78 v40.13,29.97 39.5,29.34 39.5,26.8 | v23.5,49.15 24.26,49.91 29.21,49.91 29.34,50.04 v30.48,50.04 | U$2.78 27.28,59.67 27.3,59.69 | 39.5,26.8 41.82,26.8 U$1.81 | 39.5,26.8 39.5,23.88 39.62,23.75 39.65,23.78 U$1.75 v43.31,23.78 43.91,23.78 43.94,23.75 43.94,21.21 41.91,21.21 U$1.70 | v40.51,12.83 41.79,12.83 U$1.53 41.89,12.83 42.93,12.83 43.69,12.07 43.69,8.13 44.7,7.11 44.7,4.45 44.57,4.31 C1.2 43.56,3.43 43.31,3.18 41.4,3.18 41.37,3.2 | v39.24,11.68 39.29,11.63 U$1.52 | U1.2 41.37,3.2 | 41.37,3.2 41.47,3.3 | C38.2 31.11,7.87 30.79,8.2 30.79,8.26
  Top 0.152: U$1.35 30.79,8.26 | U$1.29 27.79,8.91 | 29.85,8.26 28.45,8.26 27.79,8.91 | 29.85,8.26 30.79,8.26 | C8.C 29.85,8.25 29.85,8.26 | C42.2 27.19,8.77 27.32,8.91 27.79,8.91 | v29.85,9.02 29.85,8.26 | v19.29,11.55 U$1.12 19.31,10.21 C39.2 | v19.29,11.55 v19.3,11.56 | v19.29,11.55 14.01,11.55 14,11.56 13.79,11.36 U$1.1 12.51,10.23 12.06,9.78 10.79,9.78 C29.2 | U$1.164 U$1.163 | U$1.163 11.24,35.31 | 11.24,35.31 U$1.162 | U$1.168 U$1.169 9.8,32.28 v9.78,32.26 | U$1.178 U$1.179 9.88,27.28 v9.78,27.18 | U$1.203 U$1.202 9.81,15.78 v9.78,15.75 | U$1.195 U$1.196 9.8,18.78 v9.78,18.8 | U$1.192 9.86,20.78 v9.78,20.7 | U$1.188 9.82,22.78 v9.78,22.73 | U$1.183 v9.78,25.27 | U$1.174 9.85,29.78 v9.78,29.85 | U$1.163 11.21,35.31 v9.78,35.31 | C13.1 6.26,26.09 | U$1.156 13.79,35.64 13.46,35.31 11.24,35.31 | v19.3,39.29 v19.29,39.3 U$1.145 19.29,41.64 20.32,42.67 20.32,43.55 C41.2 | C6.C 19.56,57.4 | U$1.156 10.98,40.83 10.29,40.13 8.77,40.13 C34.2 | U$1.156 13.79,41.96 13.45,42.3 C37.2 | v45.21,21.97 45.21,21.34 44.86,20.98 44.86,20.83 44.27,20.25 44.27,15.93 44.58,15.62 J1.5
  Top 0.254: C6.C 19.56,58.29 20.07,58.8 23.28,58.8
  Top 0.305: C11.C 11.56,7.75 10.67,8.64 10.67,9.65 10.79,9.78 | C13.1 v7.37,26.29 | C12.1 v7.37,28.32 | C4.1 v7.37,31.24 | C3.1 v7.37,33.27 | J3.8 5.84,16.13 8.51,18.8 v9.78,18.8 | C41.2 20.31,49.15 | 20.31,49.15 20.31,54.75 19.56,55.5 C6.C | C6.C 19.56,57.4 | v23.5,49.15 20.31,49.15 | 20.31,49.15 18.54,49.15 17.65,50.04 C7.C 15.24,48.89 14.99,48.64 8.25,48.64 8,48.89 C10.C | SV1.3 5.46,61.98 12.06,61.98 12.19,61.85 C9.C 12.32,60.71 14.22,60.71 14.86,60.07 14.86,59.44 15.11,59.18 18.03,59.18 18.8,58.42 18.8,57.15 19.43,57.15 C6.C
  Bottom 0.152: v39.35,42.29 38.73,42.91 v38.73,47.2 v41.78,47.2 41.78,48.64 41.26,49.16 C14.2 v40.13,49.91 | C15.2 42.93,55.13 v42.93,56.13 42.12,56.94 v40.26,56.94 40.19,56.87 v37.54,56.87 | v31.11,42.8 31.46,43.14 v31.46,48.01 30.35,48.01 | v28.83,48.13 28.96,48.01 30.35,48.01 | v30.48,50.04 30.48,48.13 30.35,48.01 | v36.96,59.69 36.95,59.7 C19.2 | v30.61,59.69 30.85,59.93 C18.2 | v26.42,59.69 26.28,59.83 C17.2 | v24.26,59.44 22.61,59.44 22.21,59.83 C16.2 | C2.2 22.98,49.15 v23.5,49.15 | C40.2 v38.48,38.61 39.32,39.45 39.32,39.73 39.65,40.05 40.11,40.05 40.69,39.47 40.69,32.41 40.13,31.85 v40.13,29.97 39.64,30.47 C35.2 38.86,24.51 | R1.1 36.44,21.58 38.86,24 38.86,24.51 | J1.5 44.96,15.62 44.07,14.73 44.07,13.46 43.43,12.83 v40.51,12.83 40.39,12.83 v39.24,11.68 38.48,12.45 C33.2 37.48,9.28 37.21,9.02 v29.85,9.02 | C32.2 38.86,24.51 | v19.3,11.56 19.3,12.19 19.56,12.45 C36.2 20.07,12.56 20.07,15.11 19.43,15.75 v9.78,15.75 v9.78,18.8 v9.78,20.7 v9.78,22.73 v9.78,25.27 | C23.2 C22.2 C21.2 C20.2 C5.2 C25.2 C27.2 C26.2 C28.2 | C28.2 15.76,35.04 15.49,35.31 v9.78,35.31 | v19.3,39.29 19.3,37.97 19.68,37.59 C30.2 20.44,35.7 20.45,35.69 19.05,34.29 15.89,34.29 C28.2 | v43.31,23.78 44.04,23.78 44.7,23.11 44.7,22.48 v45.21,21.97
  Bottom 0.305: v7.37,26.29 7.37,27.18 | 7.37,27.18 v7.37,28.32 7.37,29.85 | 7.37,29.85 v7.37,31.24 7.37,32.13 | 7.37,32.13 v7.37,33.27 | v9.78,32.26 7.49,32.26 7.37,32.13 | v9.78,27.18 7.37,27.18 | v9.78,29.85 7.37,29.85 | v9.78,32.26 v9.78,35.31 | v9.78,29.85 v9.78,32.26 | v9.78,27.18 v9.78,29.85 | v9.78,25.27 v9.78,27.18
  pour Top (isolate 0.254): 0.13,67.06 49.78,67.06 49.78,-0.13 0,-0.13 0,67.18 0.13,67.18
  pour Bottom (isolate 0.254): 0.13,67.06 49.78,67.06 49.78,0.13 0,0.13 0,67.06
HSYNC  (via drill 0.35)
  Top 0.152: U$1.21 23.79,8.55 v23.62,8.38
  Bottom 0.152: v23.62,8.38 21.34,6.1 J4.3
N$1
  Top 0.152: 36.2,5.21 U1.4 35.37,6.48 33.78,6.48 33.27,5.97 33.27,3.43 C8.A | 36.2,5.21 U1.1 | C1.1 43.56,5.46 43.31,5.21 36.2,5.21 | C8.A | VDDCLK.2 29.09,1.65 30.99,1.65 31.5,2.16 31.5,2.92 31.88,3.3 C8.A
N$2
  Top 0.152: U$1.74 41.81,23.24 38.61,23.24 38.1,22.73 38.1,13.84 41.28,10.67 U1.3
N$6
  Top 0.152: U$1.167 C3.2
N$7
  Top 0.152: U$1.171 8.3,31.28 C4.2
N$8
  Top 0.152: U$1.177 8.31,28.28 C12.2
N$10
  Top 0.152: U$1.181 C13.2
N$17
  Top 0.152: 36.2,7.37 38.73,7.37
N$18  (via drill 0.35)
  Top 0.152: U$1.56 U$1.57 39.71,14.78 39.12,15.37 39.12,15.75 39.65,16.28 | U$1.61 U$1.60 39.65,16.28 | U$1.65 U$1.66 U$1.67 U$1.68 v39.41,20.28 | v39.41,20.28 39.12,20.7 39.12,21.34 39.43,21.78 U$1.71 | 39.65,16.28 39.12,16.81 39.12,19.98 v39.41,20.28
  Bottom 0.152: v39.41,20.28 38.28,20.28 R1.2
N$19
  Top 0.152: 36.32,3.05 38.73,3.05
N$23  (via drill 0.35)
  Top 0.152: v40.39,17.78 U$1.63 41.87,17.8 42.9,17.8 42.93,17.78 43.18,18.03 43.18,20.45 42.85,20.78 U$1.69 | v38.66,16.48 38.81,16.32 38.81,15.24 40.28,13.78 U$1.55
  Bottom 0.152: R2.1 38.36,18.04 | 38.36,18.04 38.62,17.78 v40.39,17.78 | v38.66,16.48 38.66,16.84 38.35,17.14 38.35,18.03 38.36,18.04
RAS
  Top 0.152: U$1.113 35.29,43.09 34.93,43.46 34.42,43.46 33.94,43.94 32.77,43.94 32.28,44.43 U$2.19
RSTB  (via drill 0.35)
  Top 0.152: U$1.73 42.84,22.78 v43.18,22.86
  Bottom 0.152: v43.18,22.86 44.2,21.84 44.2,21.21 44.7,20.7 J1.3
SCLK
  Top 0.152: U$1.59 42.83,15.78 43.79,16.74 43.79,20.19 44.55,20.96 44.55,22.96 44.83,23.24 J1.2
SDAT
  Top 0.152: U$1.62 43.05,17.27 43.48,17.7 43.48,20.32 44.25,21.08 44.25,24.94 45.09,25.78 J1.1
VAOCY
  Top 0.152: U$1.186 11.21,23.75 7.11,23.75 4.57,21.21 J3.6
VAOYC
  Top 0.152: U$1.184 10.06,24.77 10.01,24.72 6.56,24.72 5.59,23.75 J3.5
VAOYY
  Top 0.152: U$1.189 10.11,22.28 10.01,22.18 8.33,22.18 4.83,18.67 J3.7
VDD1V8  (via drill 0.35)
  Top 0.305: VDDDAC.1 3.3,9.4 3.3,10.54 v5.08,12.32 | VDDI.2 11.68,50.17 11.68,52.2 11.18,52.7 6.48,52.7 | 6.48,52.7 5.72,52.7 4.95,51.94 4.95,50.3 VDDADC.1 v3.18,50.04 v3.17,50.04 | SV1.2 6.1,57.02 6.48,56.64 6.48,52.7 | v3.17,50.8 3.43,50.55 4.19,50.55
  Bottom 0.305: v5.08,12.32 4.5,12.9 4.5,14.03 4.44,14.08 4.44,18.18 4.5,18.23 4.5,43.76 3.05,45.21 3.05,48.89 3.05,49.53 | v3.17,50.04 3.05,49.91 3.05,49.53 | 3.05,49.53 2.67,49.91 2.67,50.29 v3.17,50.8
VDD3V3  (via drill 0.35)
  Top 0.305: VDDCLK.1 22.84,3.3 21.52,1.98 15.67,1.98 13.34,4.32 7.24,4.32 4.57,6.98 4.57,10.67 5.21,11.3 v5.84,11.3 | VDDRAM.1 16,57.4 15.11,57.4 14.73,57.78 14.73,58.55 14.1,59.18 10.16,59.18 9.91,59.44 9.91,60.2 9.65,60.45 VDDO.2 6.23,60.45 v6.1,60.33
  Bottom 0.305: v5.84,11.3 5.84,13.08 5.08,13.84 5.08,54.36 | 5.08,54.36 4.95,54.48 SV1.1 | 5.08,54.36 5.08,59.31 v6.1,60.33
VDD_RAM  (via drill 0.35)
  Top 0.152: 40.28,47.52 40.51,47.75 43.31,47.75 | 43.31,47.75 44.07,47.75 44.28,47.54 U$2.43 | U$2.41 43.28,47.73 43.31,47.75 | U$2.35 40.28,47.52 | U$2.29 37.28,47.57 37.47,47.75 | 40.28,47.52 40.05,47.75 37.47,47.75 | U$2.49 41.78,57.02 v41.15,56.39 39.12,56.39 38.78,56.72 U$2.55 38.78,59.63 v38.73,59.69 | U$2.15 30.28,48.84 v29.72,49.4 | 23.28,47.75 U$2.1 22.57,45.94 v22.48,45.85 | 23.28,47.75 23.28,47.92 24.76,49.4 v29.72,49.4 | U$2.9 27.3,45.96 v27.3,48.26 | U$2.3 24.28,47.6 24.13,47.75 23.28,47.75 | 43.31,47.75 v43.31,48.64 | U$2.67 32.78,59.56 v32.65,59.69 | v28.19,59.56 28.48,59.28 28.5,59.28 28.78,58.99 U$2.75 | U$2.81 25.78,59.05 25.15,59.69 v25.15,60.33 | v29.72,49.4 29.77,49.45 36.53,49.45 37.29,48.69 37.29,47.93 37.47,47.75
  Top 0.254: v19.05,59.44 19.05,60.33 19.3,60.58 | C6.A 19.56,61.85 19.68,61.98 v24,61.98
  Top 0.305: VDDRAM.2 19.3,60.58 C6.A
  Bottom 0.152: v41.15,56.39 41.15,55.13 C15.1 41.14,53.99 43.06,52.06 C14.1 43.06,48.88 v43.31,48.64 | v27.3,48.26 28.45,49.4 v29.72,49.4 | C19.1 38.75,59.71 v38.73,59.69 38.73,58.79 38.23,58.29 33.15,58.29 32.64,58.8 | 32.64,58.8 32.65,58.81 v32.65,59.69 C18.1 | v28.19,59.56 28.08,59.68 C17.1 | 32.64,58.8 32.13,58.29 28.7,58.29 28.19,58.8 v28.19,59.56 | v28.19,59.56 26.92,58.29 25.53,58.29 25.53,59.94 v25.15,60.33 24.76,60.71 C16.1 24,60.72 v24,61.98 | v22.48,45.85 22.47,45.84 C2.1
  Bottom 0.254: C2.1 21.32,45.97 19.68,45.97 19.05,46.61 v19.05,59.44
VDDADC  (via drill 0.35)
  Top 0.152: U$1.173 U$1.172 12.36,30.78 12.83,31.24 | U$1.182 12.19,25.78 12.7,26.29 v12.7,28.07 12.7,29.85 | U$1.175 12.13,29.28 12.7,29.85 | 12.83,31.24 v12.83,32.26 12.83,34.04 v12.7,34.16 12.59,34.28 U$1.165 | 12.7,29.85 v12.95,30.1 12.95,31.11 12.83,31.24
  Top 0.254: U$1.165 9.54,34.28 7.24,36.58 7.24,46.74
  Top 0.305: VDDADC.2 5.84,47.24 6.35,46.74 7.24,46.74 C10.A
  Bottom 0.152: v12.7,28.07 C25.1 | v12.95,30.1 C27.1 | v12.83,32.26 13.83,32.26 C26.1 | v12.7,34.16 C28.1
VDDDAC  (via drill 0.35)
  Top 0.152: U$1.193 12.36,20.28 v12.83,19.81 | U$1.190 12.39,21.78 v12.83,21.34 | U$1.187 12.48,23.28 v12.83,23.62 | U$1.185 12.34,24.28 v12.83,24.77 v12.83,23.62 | v12.83,19.81 12.95,19.68 v12.95,17.02 12.21,16.28 U$1.201 10.04,16.28 10.01,16.3 8.56,16.3 7.62,15.37 7.62,9.65 7.24,9.27 VDDDAC.2 | v12.83,19.81 v12.83,21.34 | v12.83,21.34 v12.83,23.62
  Top 0.305: VDDDAC.2 5.97,6.98 6.6,6.35 C11.A
  Bottom 0.152: v12.95,17.02 C23.1 | v12.83,19.81 12.83,19.43 13.08,19.18 C22.1 | v12.83,21.34 C21.1 | v12.83,23.62 C20.1 | C5.1 13.96,24.9 13.97,24.89 13.84,24.77 v12.83,24.77
VDDI  (via drill 0.35)
  Top 0.152: U$1.99 39.53,35.78 v39.5,35.81 | U$1.133 25.29,38.94 24.1,37.75 | 24.1,37.75 23.57,37.22 23.57,36.73 24.73,35.58 29.21,35.58 30.98,37.35 | 30.98,37.35 33.13,39.5 33.66,39.5 33.79,39.64 U$1.116 | v31.37,36.96 30.98,37.35 | v37.72,33.02 37.72,15.75 v37.54,15.75 33.79,12 | v40.26,15.49 40.39,15.49 40.64,15.24 41.81,15.24 U$1.58 | 33.79,12 U$1.41 C38.1 | 33.79,12 25.84,12 25.29,11.45 U$1.24 25.29,7.97 C42.1 25.39,6.87 25.4,6.86 25.15,6.6 17.78,6.6 17.53,6.86 17.53,7.86 | C39.1 17.53,7.86 | U$1.6 16.29,8.09 16.52,7.86 17.53,7.86 | C41.1 22.11,42.92 v22.73,42.29 | v23.24,38.61 24.1,37.75 | U$1.151 16.29,42.07 16.45,42.23 v16.51,42.29
  Top 0.254: C37.1 15.98,43.46 16.45,42.99 16.45,42.23
  Top 0.305: VDDI.1 12.96,47.24 13.46,46.74 C7.A 15.24,43.47 C37.1
  Bottom 0.152: v39.5,35.81 39.25,36.06 C40.1 37.39,34.96 37.39,33.49 37.06,33.17 | v31.37,36.96 31.46,36.87 31.46,36.22 34.51,33.17 37.06,33.17 | 37.06,33.17 37.21,33.02 v37.72,33.02 | v37.54,15.75 37.8,15.49 v40.26,15.49 | v22.73,42.29 23.24,41.78 v23.24,38.61
  Bottom 0.305: v16.51,42.29 v22.73,42.29
VDDO  (via drill 0.35)
  Top 0.152: U$1.93 40.65,32.78 40.51,32.64 v40.13,32.64 | U$1.110 36.79,39.79 37.08,39.5 v39.88,39.5 | U$1.64 40.68,18.28 40.62,18.34 39.88,18.34 v39.67,18.54 | U$1.47 36.79,11.34 v36.7,11.43 | U$1.18 22.29,11.24 v22.86,11.81 22.86,12.57 22.66,12.78 U$1.208 v9.52,12.78 9.47,12.78 8.88,12.18 C29.1 | U$1.139 22.29,38.93 v22.22,38.86 | v13.21,38.35 13.13,38.28 U$1.157 8.83,38.28 C34.1
  Top 0.305: J3.9 2.79,13.72 v6.73,13.72 | v12.19,55.88 12.19,57.4 | 12.19,57.4 C9.A | VDDO.1 11.94,57.66 12.19,57.4 | v14.61,38.73 18.97,38.73 19.04,38.66 22.02,38.66 22.1,38.73 v22.22,38.86
  Bottom 0.152: v39.88,39.5 39.88,36.22 40.05,36.04 40.05,32.72 v40.13,32.64 39.23,32.64 C35.1 37.85,32.26 35.18,29.59 35.18,24.51 | R2.2 36.44,18.91 36.7,19.18 39.62,19.18 | 39.62,19.18 44.07,19.18 44.45,18.8 44.45,18.54 44.83,18.16 J1.4 | v39.67,18.54 39.62,18.59 39.62,19.18 | 35.18,24.51 35.18,18.92 35.94,18.16 R2.2 | C32.1 35.18,24.51 | v36.7,11.43 36.58,11.56 36.58,12.07 36.2,12.45 C33.1 | R2.2 36.44,14.47 35.68,13.71 C33.1 | C33.1 22.86,12.45 | 22.86,12.45 C36.1 | v22.86,11.81 22.86,12.45 | v22.22,38.86 C30.1
  Bottom 0.305: v6.73,13.72 8.76,13.72 9.52,12.95 v9.52,12.78 | C30.1 22.24,14.36 21.97,14.1 21.97,12.46 C36.1 | v12.19,55.88 12.19,40.13 13.21,39.12 v13.21,38.35 13.59,38.73 v14.61,38.73
VIN0
  Top 0.152: U$1.166 9.09,33.78 8.76,34.1 5.97,34.1 5.78,33.91 J3.1
VIN1
  Top 0.152: U$1.170 10.08,31.78 10.01,31.7 9.13,31.7 8.76,32.07 5.78,32.07 5.08,31.37 J3.2
VIN2
  Top 0.152: U$1.176 11.19,28.83 9.08,28.83 8.76,29.15 5.97,29.15 5.65,28.83 J3.3
VIN3
  Top 0.152: U$1.180 10.16,26.78 10.01,26.62 9.26,26.62 8.76,27.12 5.78,27.12 4.95,26.29 J3.4
VSYNC  (via drill 0.35)
  Top 0.152: U$1.20 23.29,9.2 v22.48,8.38
  Bottom 0.152: v22.48,8.38 20.95,6.86 19.68,6.86 18.8,5.97 J4.2
WE
  Top 0.152: U$2.17 31.28,44.56 32.51,43.33 33.68,43.33 34.29,42.72 U$1.115

### Text on the board
tNames: OSDeluxe by DRONEDOKTOR.EU | GND | 1v8 | 3v3 | 0 | OSDeluxe Video proc v1.0 | 1 | 2 | 3 | YX | CX | YY | GND | 3v3
bNames: OSDeluxe by DRONEDOKTOR.EU | SDAT | SCLK | RSTB | 3v3 | GND | VSYNC | HSYNC | FLD